# Altium project PCB_Project1.PrjPCB
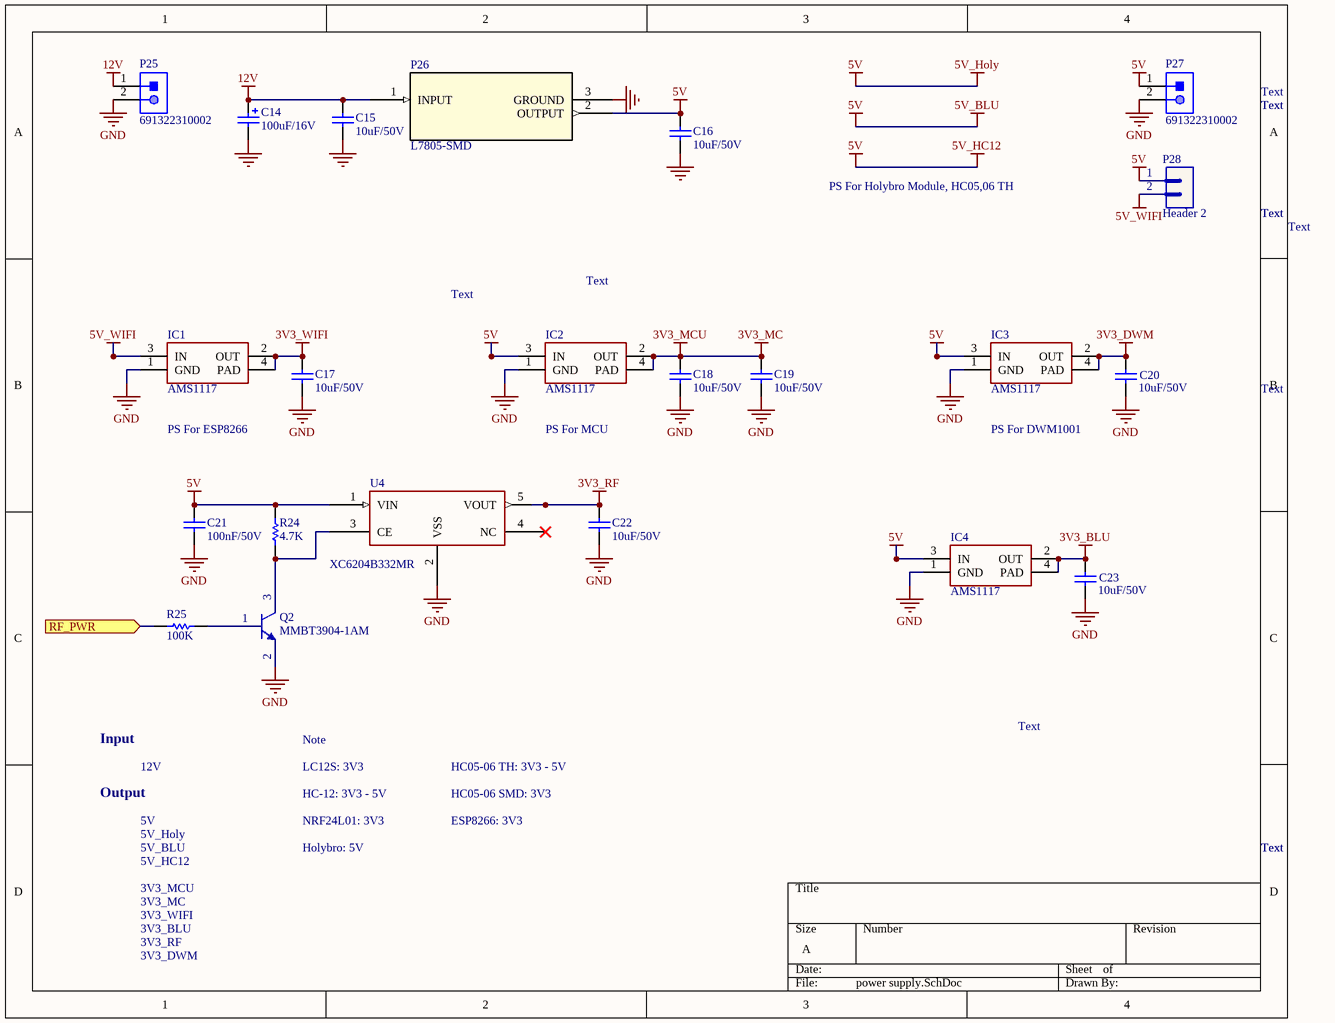
[diagram p0: power supply.SchDoc]
8 sheets, 151 parts. Net scope: flat (ports and power ports of the same name join across sheets).
Board files: xecanbang.PcbDoc, test.PcbDoc
Sheets:
  power supply.SchDoc
  MCU.SchDoc
  sensor.SchDoc
  motor_controller.SchDoc
  bluetooth.SchDoc
  decawave.SchDoc
  wifi.SchDoc
  radio_frequency.SchDoc

## Sheet power supply.SchDoc
size A

### Parts
C14  value 100uF/16V  [CAP-SM-AL-SIZE-D-D6L6]  (hidden comment: Cap-Al-100uF-16V-D6L5)
C15  value 10uF/50V  [CAP-SM-0805]  (hidden comment: Cap-10uF-50V-0805)
C16  value 10uF/50V  [CAP-SM-0805]  (hidden comment: Cap-10uF-50V-0805)
C17  value 10uF/50V  [CAP-SM-0805]  (hidden comment: Cap-10uF-50V-0805)
C18  value 10uF/50V  [CAP-SM-0805]  (hidden comment: Cap-10uF-50V-0805)
C19  value 10uF/50V  [CAP-SM-0805]  (hidden comment: Cap-10uF-50V-0805)
C20  value 10uF/50V  [CAP-SM-0805]  (hidden comment: Cap-10uF-50V-0805)
C21  value 100nF/50V  [CAP-SM-0805]  (hidden comment: Cap-100nF-50V-0805)
C22  value 10uF/50V  [CAP-SM-0805]  (hidden comment: Cap-10uF-50V-0805)
C23  value 10uF/50V  [CAP-SM-0805]  (hidden comment: Cap-10uF-50V-0805)
IC1  AMS1117  [SOT223]
IC2  AMS1117  [SOT223]
IC3  AMS1117  [SOT223]
IC4  AMS1117  [SOT223]
P25  691322310002  [691322310002]
P26  L7805-SMD  [L7805]
P27  691322310002  [691322310002]
P28  Header 2  [JP2]
Q2  MMBT3904-1AM  [SOT23_NEX]
R24  value 4.7K  [RES-SM-0805]  (hidden comment: Res-4.7K-0805)
R25  value 100K  [RES-SM-0805]  (hidden comment: Res-100K-0805)
U4  XC6204B332MR  [XC6204/05_SOT-00]

### Ports
RF_PWR (in)

### Nets
3V3_BLU: C23.2 IC4.2(OUT) IC4.4(PAD)
3V3_DWM: C20.2 IC3.2(OUT) IC3.4(PAD)
3V3_MC: C18.2 C19.2 IC2.2(OUT) IC2.4(PAD)  [also labelled 3V3_MCU]
3V3_RF: C22.2 U4.5(VOUT)
3V3_WIFI: C17.2 IC1.2(OUT) IC1.4(PAD)
5V: C16.2 C21.2 IC2.3(IN) IC3.3(IN) IC4.3(IN) P26.2(OUTPUT) P27.1 P28.1 R24.2 U4.1(VIN)  [also labelled 5V_BLU, 5V_HC12, 5V_Holy]
5V_WIFI: IC1.3(IN) P28.2
12V: C14.1 C15.2 P25.1 P26.1(INPUT)
GND: C14.2 C15.1 C16.1 C17.1 C18.1 C19.1 C20.1 C21.1 C22.1 C23.1 IC1.1(GND) IC2.1(GND) IC3.1(GND) IC4.1(GND) P25.2 P26.3(GROUND) P27.2 Q2.2(E) U4.2(VSS)
NetQ2_1: Q2.1(B) R25.2
NetQ2_3: Q2.3(C) R24.1 U4.3(CE)
NetR25_1: R25.1 ; port RF_PWR

Not connected (* = marked no-connect by the designer): U4 4(NC)*

### Notes on the sheet
- Text
- PS For Holybro Module, HC05,06 TH
- PS For ESP8266
- PS For MCU
- PS For DWM1001
- Input
- 12V
- Note
- LC12S: 3V3
- HC05-06 TH: 3V3 - 5V
- Output
- 5V
- 5V_Holy
- HC-12: 3V3 - 5V
- NRF24L01: 3V3
- HC05-06 SMD: 3V3
- ESP8266: 3V3
- 5V_BLU
- 5V_HC12
- 3V3_MCU
- 3V3_MC
- Holybro: 5V
- 3V3_WIFI
- 3V3_BLU
- 3V3_RF
- 3V3_DWM

### Library data of the parts
C14 = Cap-Al-100uF-16V-D6L5: CAP ALUM 100UF 20% 16V SMD; Manufacturer: Nichicon; Manufacturer Part Number: UWX1C101MCL1GB; Local Supplier: thegioiic; Local Supplier Link: https://thegioiic.com/products/tu-nhom-smd-100uf-16v-d6-3l5-4; Supplier 1: Digikey; Supplier 1 Part Number: 493-2105-1-ND; Supplier 1 Link: https://www.digikey.com/product-detail/en/nichicon/UWX1C101MCL1GB/493-2105-1-ND/590080
C15-C20 C22 C23 = Cap-10uF-50V-0805: CAP CER 10UF 50V X5R 0805; Manufacturer: Yageo; Manufacturer Part Number: CC0805KKX5R9BB106; Local Supplier: thegioiic; Local Supplier Link: https://thegioiic.com/products/tu-10uf-50v-0805; Supplier 1: Digikey; Supplier 1 Link: https://www.digikey.com/product-detail/en/yageo/CC0805KKX5R9BB106/311-3499-2-ND/7164383; Supplier 1 Part Number: 311-3499-2-ND
C21 = Cap-100nF-50V-0805: CAP CER 0.1UF 50V Y5V 0805; Manufacturer: Samsung Electro-Mechanics; Manufacturer Part Number: CL21F104ZBCNNNC; Local Supplier: thegioiic; Local Supplier Link: https://thegioiic.com/products/tu-100nf-0-1uf-50v-0805; Supplier 1: Digikey; Supplier 1 Part Number: 1276-1007-1-ND; Supplier 1 Link: https://www.digikey.com/product-detail/en/samsung-electro-mechanics/CL21F104ZBCNNNC/1276-1007-1-ND/3889093
IC1-IC4 = AMS1117: Available in 1.8V, 2.5V, 2.85V, 3.3V, 5V, and  Adjustable Versions; Value: LM317
P25 P27 = 691322310002: WR-TBL Serie 322 Horizontal PCB Header, Pluggable, pitch 3.81mm, 2p; Compliance: RoHS; Modularity: No; Pin Number: 2; Rated Current [UL]: 10A; Working Voltage [UL]: 300VAC; ComponentLink1Description: Manufacturer; ComponentLink1URL: http://www.we-online.de; ComponentLink2URL: https://katalog.we-online.de/em/datasheet/691322310002.pdf; ComponentLink2Description: Datasheet; Mounting Technology: THT; Part Number: 691322310002; Packaging: Box; Operating Temperature: -40 to +105degC; PCB/Cable/Panel: PCB; Pitch: 3.81mm; Published Date: October 2019; Type: Horizontal; Publisher: Wurth Elektronik; Application: Pluggable
P26 = L7805
P28 = Header 2: Header, 2-Pin; LatestRevisionDate: 17-Jul-2002; LatestRevisionNote: Re-released for DXP Platform.; Publisher: Altium Limited
R24 = Res-4.7K-0805: RES SMD 4.7K OHM 5% 1/8W 0805; Manufacturer: Yageo; Manufacturer Part Number: RC0805JR-074K7L; Local Supplier: thegioiic; Local Supplier Link: https://thegioiic.com/products/dien-tro-4-7k-ohm-0805-5; Supplier 1: Digikey; Supplier 1 Link: https://www.digikey.com/product-detail/en/yageo/RC0805JR-074K7L/311-4.7KARCT-ND/731274; Supplier 1 Part Number: 311-4.7KARCT-ND
R25 = Res-100K-0805: RES 0 OHM JUMPER 0805; Manufacturer: Vishay Dale; Manufacturer Part Number: WSL080500000ZEA9; Local Supplier: thegioiic; Local Supplier Link: https://thegioiic.com/products/dien-tro-0-ohm-0805-5; Supplier 1: Digikey; Supplier 1 Link: https://www.digikey.com/product-detail/en/vishay-dale/WSL080500000ZEA9/541-3928-1-ND/7423223; Supplier 1 Part Number: 541-3928-1-ND
U4 = XC6204B332MR: Vendor: Torex Semiconductor; Built_By: EMA_UL_Team; SourceLibrary: Torex_2016-07-05_1; Manufacturer_Part_Number: XC6204B332MR; Copyright: Copyright (C) 2018 Accelerated Designs. All rights reserved; RefDes: RefDes; Type: DEV

## Sheet MCU.SchDoc
size A
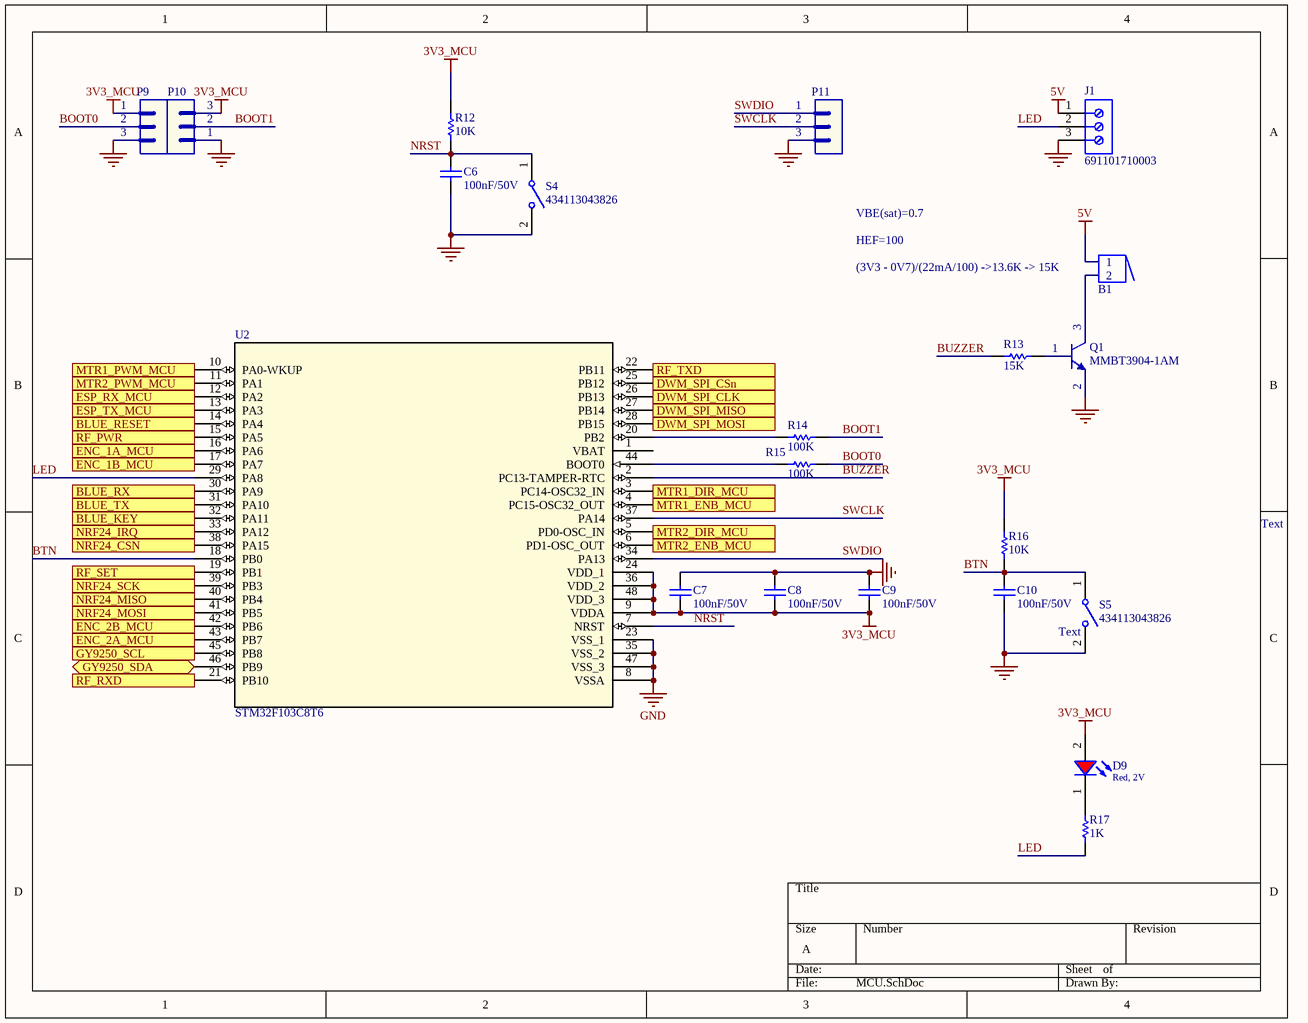
[diagram p1: MCU.SchDoc]

### Parts
B1  Buzzer  [BUZZER]  (value not drawn)
C6  value 100nF/50V  [CAP-SM-0805]  (hidden comment: Cap-100nF-50V-0805)
C7  value 100nF/50V  [CAP-SM-0805]  (hidden comment: Cap-100nF-50V-0805)
C8  value 100nF/50V  [CAP-SM-0805]  (hidden comment: Cap-100nF-50V-0805)
C9  value 100nF/50V  [CAP-SM-0805]  (hidden comment: Cap-100nF-50V-0805)
C10  value 100nF/50V  [CAP-SM-0805]  (hidden comment: Cap-100nF-50V-0805)
D9  Red, 2V  [WL-SMCW_0805]
J1  691101710003  [691101710003]
P9  (no value)  [JP3]
P10  (no value)  [JP3]
P11  (no value)  [JP3]
Q1  MMBT3904-1AM  [SOT23_NEX]
R12  value 10K  [RES-SM-0805]  (hidden comment: Res-10k-0805)
R13  value 15K  [RES-SM-0805]  (hidden comment: Res-15K-0805)
R14  value 100K  [RES-SM-0805]  (hidden comment: Res-100K-0805)
R15  value 100K  [RES-SM-0805]  (hidden comment: Res-100K-0805)
R16  value 10K  [RES-SM-0805]  (hidden comment: Res-10k-0805)
R17  value 1K  [RES-SM-0805]  (hidden comment: Res-1K-0805)
S4  434113043826  [434113043826]
S5  434113043826  [434113043826]
U2  STM32F103C8T6  [LQFP-48]

### Ports
BLUE_KEY (out), BLUE_RESET (out), BLUE_RX (out), BLUE_TX (in), DWM_SPI_CLK (out), DWM_SPI_CSn (out), DWM_SPI_MISO (in), DWM_SPI_MOSI (out), ENC_1A_MCU (in), ENC_1B_MCU (in), ENC_2A_MCU (in), ENC_2B_MCU (in), ESP_RX_MCU (out), ESP_TX_MCU (in), GY9250_SCL (out), GY9250_SDA (bidir), MTR1_DIR_MCU (out), MTR1_ENB_MCU (out), MTR1_PWM_MCU (out), MTR2_DIR_MCU (out), MTR2_ENB_MCU (out), MTR2_PWM_MCU (out), NRF24_CSN (out), NRF24_IRQ (in), NRF24_MISO (in), NRF24_MOSI (out), NRF24_SCK (out), RF_PWR (out), RF_RXD (out), RF_SET (out), RF_TXD (in)

### Nets
3V3_MCU: C7.1 C8.1 C9.1 D9.2(A) P9.1 P10.3 R12.1 R16.1 U2.9(VDDA) U2.24(VDD_1) U2.36(VDD_2) U2.48(VDD_3)  [project net 3V3_MC]
5V: B1.1 J1.1
GND: C6.1 C7.2 C8.2 C9.2 C10.1 J1.3 P9.3 P10.1 P11.3 Q1.2(E) S4.2 S5.2 U2.8(VSSA) U2.23(VSS_1) U2.35(VSS_2) U2.47(VSS_3)
BLUE_RX: U2.30(PA9) ; port BLUE_RX
BLUE_TX: U2.31(PA10) ; port BLUE_TX
BOOT0: P9.2 R15.2
BOOT1: P10.2 R14.2
BTN: C10.2 R16.2 S5.1 U2.18(PB0)
BUZZER: R13.1 U2.2(PC13-TAMPER-RTC)
DWM_SPI_CLK: U2.26(PB13) ; port DWM_SPI_CLK
DWM_SPI_CSn: U2.25(PB12) ; port DWM_SPI_CSn
DWM_SPI_MISO: U2.27(PB14) ; port DWM_SPI_MISO
DWM_SPI_MOSI: U2.28(PB15) ; port DWM_SPI_MOSI
ESP_TX: U2.13(PA3) ; port ESP_TX_MCU
LED: J1.2 R17.1 U2.29(PA8)
NRST: C6.2 R12.2 S4.1 U2.7(NRST)
SWCLK: P11.2 U2.37(PA14)
SWDIO: P11.1 U2.34(PA13)
NetB1_2: B1.2 Q1.3(C)
NetD9_1: D9.1(K) R17.2
NetM2_11: U2.14(PA4) ; port BLUE_RESET
NetM5_4: U2.38(PA15) ; port NRF24_CSN
NetM5_5: U2.39(PB3) ; port NRF24_SCK
NetM5_6: U2.41(PB5) ; port NRF24_MOSI
NetM5_7: U2.40(PB4) ; port NRF24_MISO
NetM5_8: U2.33(PA12) ; port NRF24_IRQ
NetM6_2: U2.21(PB10) ; port RF_RXD
NetM6_3: U2.22(PB11) ; port RF_TXD
NetM6_4: U2.19(PB1) ; port RF_SET
NetM9_3: U2.45(PB8) ; port GY9250_SCL
NetM9_4: U2.46(PB9) ; port GY9250_SDA
NetQ1_1: Q1.1(B) R13.2
NetR14_1: R14.1 U2.20(PB2)
NetR15_1: R15.1 U2.44(BOOT0)
NetR25_1: U2.15(PA5) ; port RF_PWR
NetR28_1: U2.12(PA2) ; port ESP_RX_MCU
NetU2_3: U2.3(PC14-OSC32_IN) ; port MTR1_DIR_MCU
NetU2_4: U2.4(PC15-OSC32_OUT) ; port MTR1_ENB_MCU
NetU2_5: U2.5(PD0-OSC_IN) ; port MTR2_DIR_MCU
NetU2_6: U2.6(PD1-OSC_OUT) ; port MTR2_ENB_MCU
NetU2_10: U2.10(PA0-WKUP) ; port MTR1_PWM_MCU
NetU2_11: U2.11(PA1) ; port MTR2_PWM_MCU
NetU2_16: U2.16(PA6) ; port ENC_1A_MCU
NetU2_17: U2.17(PA7) ; port ENC_1B_MCU
NetU2_32: U2.32(PA11) ; port BLUE_KEY
NetU2_42: U2.42(PB6) ; port ENC_2B_MCU
NetU2_43: U2.43(PB7) ; port ENC_2A_MCU

Not connected (* = marked no-connect by the designer): U2 1(VBAT)

### Notes on the sheet
- VBE(sat)=0.7
- HEF=100
- (near B1) (3V3 - 0V7)/(22mA/100) ->13.6K -> 15K
- Text
- (near S5) Text

### Library data of the parts
C6-C10 = Cap-100nF-50V-0805: as C21 on sheet power supply; Local Supplier: thegioiic; Local Supplier Link: https://thegioiic.com/products/tu-100nf-0-1uf-50v-0805; Supplier 1: Digikey; Supplier 1 Part Number: 1276-1007-1-ND; Supplier 1 Link: https://www.digikey.com/product-detail/en/samsung-electro-mechanics/CL21F104ZBCNNNC/1276-1007-1-ND/3889093
D9 = 150080RS75000: WL-SMCW SMT Mono-color Chip LED Waterclear, size 0805, Red, 2V, 140deg; Chip Technology: AlInGaP; Dominant Wavelength typ.: 625nm; Luminous Intensity typ.: 150mcd; Peak Wavelength typ.: 630nm; Viewing Angle: 140deg; ComponentLink1Description: Manufacturer; ComponentLink1URL: http://www.we-online.de; ComponentLink2URL: https://www.we-online.com/catalog/datasheet/150080RS75000.pdf; ComponentLink2Description: Datasheet; Forward Voltage typ.: 2V; Emitting Color: Red; Mounting Technology: SMT; Operating Temperature: -40 to +85degC; Published Date: December 2019; Part Number: 150080RS75000; Packaging: Tape and Reel; Size: 0805; Publisher: Wurth Elektronik
J1 = 691101710003: WR-TBL Serie 101 Horizontal Entry Modular, Pressure Clamp, pitch 5mm, 3p; Compliance: Lead free / RoHS; Modularity: Yes; PCB/Cable/Panel: PCB; Pin Number: 3; Rated Current [UL]: 16A; Working Voltage [UL]: 250VAC; ComponentLink1Description: Manufacturer; ComponentLink1URL: http://www.we-online.de; ComponentLink2URL: https://katalog.we-online.de/em/datasheet/691101710003.pdf; ComponentLink2Description: Datasheet; Mounting Technology: THT; Part Number: 691101710003; Packaging: Box; Operating Temperature: -40 to +105degC; Pitch: 5mm; Published Date: October 2019; Type: Horizontal; Publisher: Wurth Elektronik; Application: Pressure Clamp
P9-P11 = Header 3: Header, 3-Pin; LatestRevisionDate: 17-Jul-2002; LatestRevisionNote: Re-released for DXP Platform.; Publisher: Altium Limited
R12 R16 = Res-10k-0805: RES 10K OHM 1% 1/4W 0805; Manufacturer: Stackpole Electronics Inc; Manufacturer Part Number: RNCP0805FTD10K0; Local Supplier: thegioiic; Local Supplier Link: https://thegioiic.com/products/dien-tro-10k-ohm-0805-5; Supplier 1: Digikey; Supplier 1 Link: https://www.digikey.com/product-detail/en/stackpole-electronics-inc/RNCP0805FTD10K0/RNCP0805FTD10K0CT-ND/2240601; Supplier 1 Part Number: RNCP0805FTD10K0CT-ND
R13 = Res-15K-0805: RES 15K OHM 1% 1/4W 0805; Manufacturer: TE Connectivity Passive Product; Manufacturer Part Number: CRGCQ0805F15K; Local Supplier: thegioiic; Local Supplier Link: https://thegioiic.com/products/dien-tro-15k-ohm-0805-1; Supplier 1: Digikey; Supplier 1 Part Number: A129763CT-ND; Supplier 1 Link: https://www.digikey.com/product-detail/en/te-connectivity-passive-product/CRGCQ0805F15K/A129763CT-ND/8577595
R14 R15 = Res-100K-0805: as R25 on sheet power supply; Local Supplier: thegioiic; Local Supplier Link: https://thegioiic.com/products/dien-tro-0-ohm-0805-5; Supplier 1: Digikey; Supplier 1 Link: https://www.digikey.com/product-detail/en/vishay-dale/WSL080500000ZEA9/541-3928-1-ND/7423223; Supplier 1 Part Number: 541-3928-1-ND
R17 = Res-1K-0805: RES 1K OHM 1% 1/4W 0805; Manufacturer: Stackpole Electronics Inc; Manufacturer Part Number: RNCP0805FTD1K00; Local Supplier: thegioiic; Local Supplier Link: https://thegioiic.com/products/dien-tro-1k-ohm-0805-5; Supplier 1: Digikey; Supplier 1 Link: https://www.digikey.com/product-detail/en/stackpole-electronics-inc/RNCP0805FTD1K00/RNCP0805FTD1K00CT-ND/2240568; Supplier 1 Part Number: RNCP0805FTD1K00CT-ND
S4 S5 = 434113043826: WS-TASV J-Bend SMT Tact Switch 6x3.5mm, height 4.3mm, 260gf; Rated Voltage: 12VDC; Rated Current: 50mA; Washable: No; ComponentLink1Description: Manufacturer; ComponentLink1URL: http://www.we-online.de; ComponentLink2Description: Datasheet; ComponentLink2URL: https://katalog.we-online.com/em/datasheet/434113043826.pdf; Operating Temperature: -40 to +85degC; Part Number: 434113043826; Published Date: September 2019; Contact Material: Stainless Steel; Height: 4.3mm; Mounting Technology: SMT; Contact Plating: Silver; Operation Force: 260gf; Packaging: Tape and Reel; Terminal Material: Copper Alloy; Publisher: Wurth Elektronik; Terminal Plating: Silver
U2 = STM32F103C8T6: No Description Available; Vendor: STMicroelectronics; Built_By: EMA_UL_Team; Manufacturer_Part_Number: STM32F103C8T6; Copyright: Copyright (C) 2018 Accelerated Designs. All rights reserved; RefDes: RefDes; Type: DEV

## Sheet sensor.SchDoc
size A
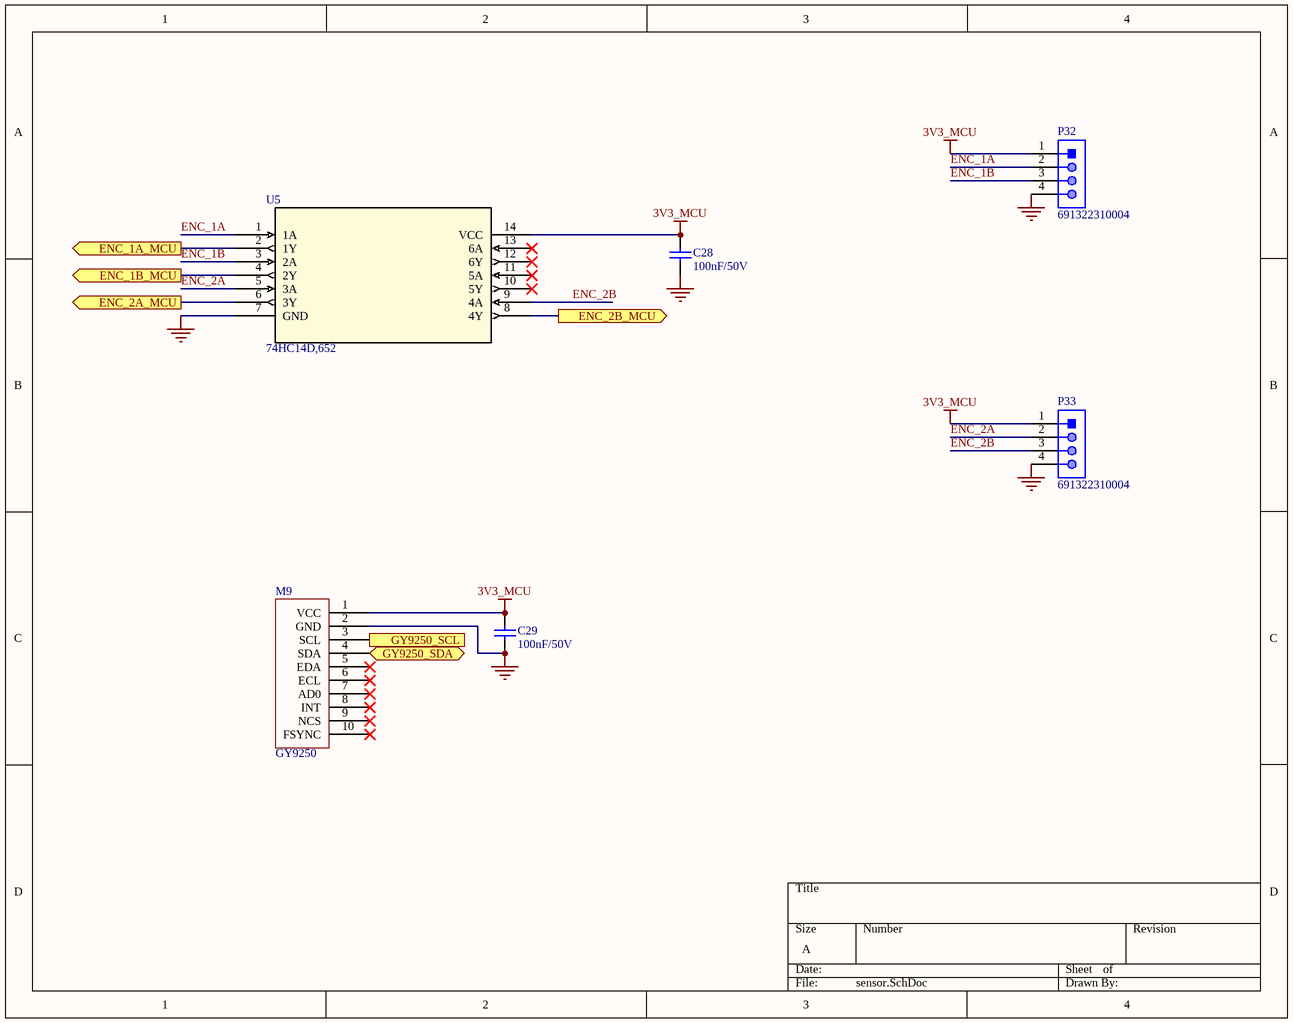
[diagram p2: sensor.SchDoc]

### Parts
C28  value 100nF/50V  [CAP-SM-0805]  (hidden comment: Cap-100nF-50V-0805)
C29  value 100nF/50V  [CAP-SM-0805]  (hidden comment: Cap-100nF-50V-0805)
M9  GY9250  [GY9250]
P32  691322310004  [691322310004]
P33  691322310004  [691322310004]
U5  74HC14D,652  [SOT108-1_NEX]

### Ports
ENC_1A_MCU (out), ENC_1B_MCU (out), ENC_2A_MCU (out), ENC_2B_MCU (out), GY9250_SCL (in), GY9250_SDA (bidir)

### Nets
3V3_MCU: C28.2 C29.2 M9.1(VCC) P32.1 P33.1 U5.14(VCC)  [project net 3V3_MC]
GND: C28.1 C29.1 M9.2(GND) P32.4 P33.4 U5.7(GND)
ENC_1A: P32.2 U5.1(1A)
ENC_1B: P32.3 U5.3(2A)
ENC_2A: P33.2 U5.5(3A)
ENC_2B: P33.3 U5.9(4A)
NetM9_3: M9.3(SCL) ; port GY9250_SCL
NetM9_4: M9.4(SDA) ; port GY9250_SDA
NetU2_16: U5.2(1Y) ; port ENC_1A_MCU
NetU2_17: U5.4(2Y) ; port ENC_1B_MCU
NetU2_42: U5.8(4Y) ; port ENC_2B_MCU
NetU2_43: U5.6(3Y) ; port ENC_2A_MCU

Not connected (* = marked no-connect by the designer): M9 5(EDA)* 6(ECL)* 7(AD0)* 8(INT)* 9(NCS)* 10(FSYNC)*; U5 10(5Y)* 11(5A)* 12(6Y)* 13(6A)*

### Library data of the parts
C28 C29 = Cap-100nF-50V-0805: as C21 on sheet power supply; Local Supplier: thegioiic; Local Supplier Link: https://thegioiic.com/products/tu-100nf-0-1uf-50v-0805; Supplier 1: Digikey; Supplier 1 Part Number: 1276-1007-1-ND; Supplier 1 Link: https://www.digikey.com/product-detail/en/samsung-electro-mechanics/CL21F104ZBCNNNC/1276-1007-1-ND/3889093
P32 P33 = 691322310004: WR-TBL Serie 322 Horizontal PCB Header, Pluggable, pitch 3.81mm, 4p; Compliance: RoHS; Modularity: No; Pin Number: 4; Rated Current [UL]: 10A; Working Voltage [UL]: 300VAC; ComponentLink1Description: Manufacturer; ComponentLink1URL: http://www.we-online.de; ComponentLink2URL: https://katalog.we-online.de/em/datasheet/691322310004.pdf; ComponentLink2Description: Datasheet; Mounting Technology: THT; Part Number: 691322310004; Packaging: Box; Operating Temperature: -40 to +105degC; PCB/Cable/Panel: PCB; Pitch: 3.81mm; Published Date: October 2019; Type: Horizontal; Publisher: Wurth Elektronik; Application: Pluggable
U5 = 74HC14D,652: No Description Available; Vendor: Nexperia; SourceLibrary: Nexperia_2018-05-2018; Manufacturer_Part_Number: 74HC14D,652; Copyright: Copyright (C) 2016 Accelerated Designs. All rights reserved; RefDes: RefDes; Type: DEV

## Sheet motor_controller.SchDoc
size A
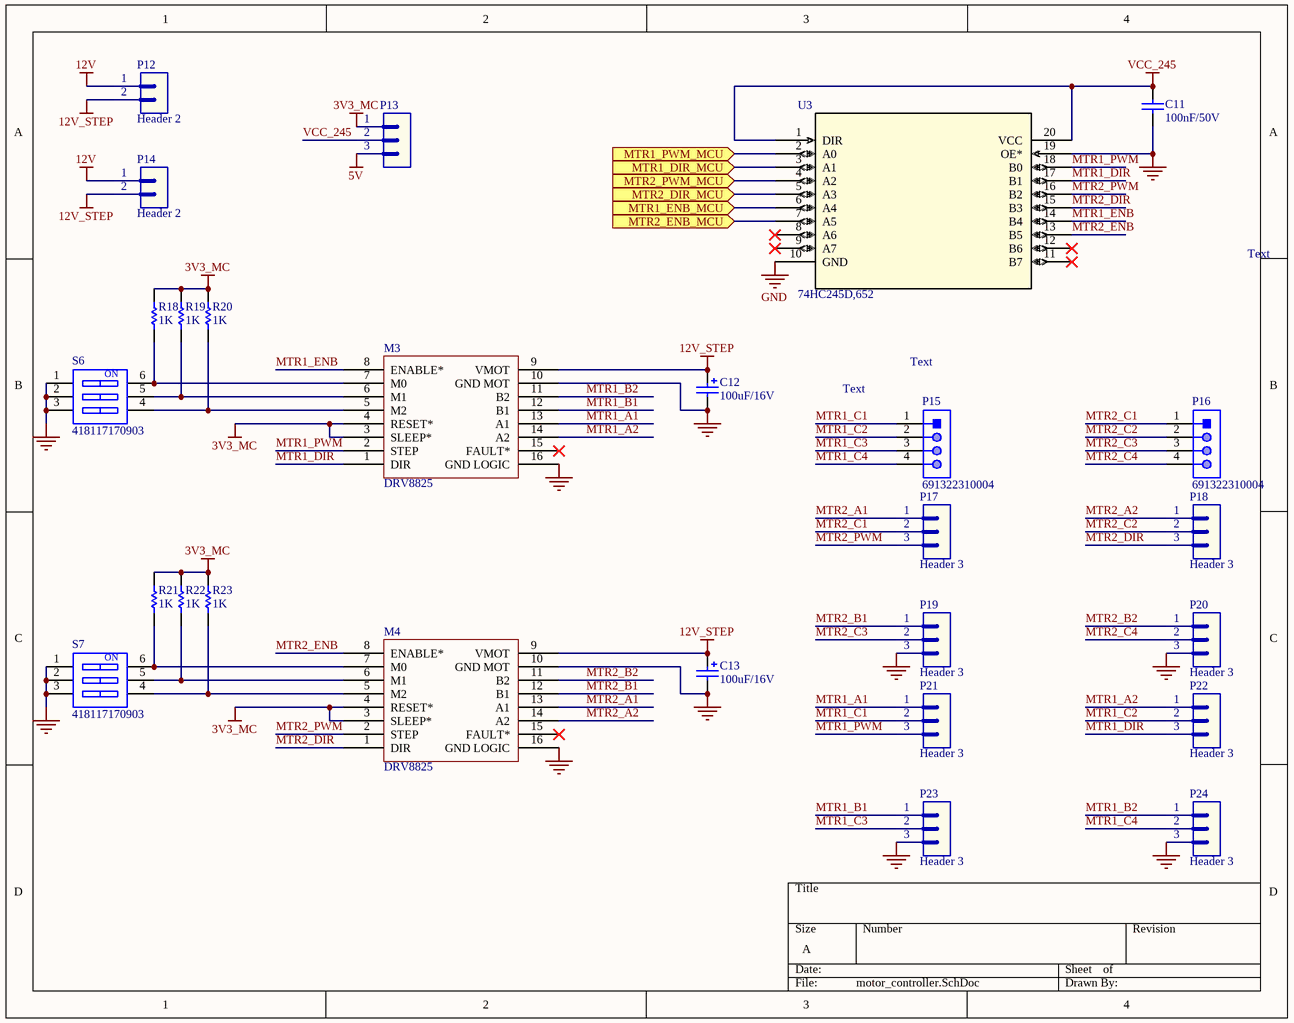
[diagram p3: motor_controller.SchDoc]

### Parts
C11  value 100nF/50V  [CAP-SM-0805]  (hidden comment: Cap-100nF-50V-0805)
C12  value 100uF/16V  [CAP-SM-AL-SIZE-D-D6L6]  (hidden comment: Cap-Al-100uF-16V-D6L5)
C13  value 100uF/16V  [CAP-SM-AL-SIZE-D-D6L6]  (hidden comment: Cap-Al-100uF-16V-D6L5)
M3  DRV8825  [DRV8825]
M4  DRV8825  [DRV8825]
P12  Header 2  [JP2]
P13  Header 3  [JP3]  (value not drawn)
P14  Header 2  [JP2]
P15  691322310004  [691322310004]
P16  691322310004  [691322310004]
P17  Header 3  [JP3]
P18  Header 3  [JP3]
P19  Header 3  [JP3]
P20  Header 3  [JP3]
P21  Header 3  [JP3]
P22  Header 3  [JP3]
P23  Header 3  [JP3]
P24  Header 3  [JP3]
R18  value 1K  [RES-SM-0805]  (hidden comment: Res-1K-0805)
R19  value 1K  [RES-SM-0805]  (hidden comment: Res-1K-0805)
R20  value 1K  [RES-SM-0805]  (hidden comment: Res-1K-0805)
R21  value 1K  [RES-SM-0805]  (hidden comment: Res-1K-0805)
R22  value 1K  [RES-SM-0805]  (hidden comment: Res-1K-0805)
R23  value 1K  [RES-SM-0805]  (hidden comment: Res-1K-0805)
S6  418117170903  [418117170903]
S7  418117170903  [418117170903]
U3  74HC245D,652  [SOT163-1_NEX]

### Ports
MTR1_DIR_MCU (in), MTR1_ENB_MCU (in), MTR1_PWM_MCU (in), MTR2_DIR_MCU (in), MTR2_ENB_MCU (in), MTR2_PWM_MCU (in)

### Nets
3V3_MC: M3.3(SLEEP*) M3.4(RESET*) M4.3(SLEEP*) M4.4(RESET*) P13.1 R18.2 R19.2 R20.2 R21.2 R22.2 R23.2
5V: P13.3
12V: P12.1 P14.1
12V_STEP: C12.1 C13.1 M3.9(VMOT) M4.9(VMOT) P12.2 P14.2
GND: C11.1 C12.2 C13.2 M3.10(GND_MOT) M3.16(GND_LOGIC) M4.10(GND_MOT) M4.16(GND_LOGIC) P19.3 P20.3 P23.3 P24.3 S6.1 S6.2 S6.3 S7.1 S7.2 S7.3 U3.10(GND) U3.19(OE*)
VCC_245: C11.2 P13.2 U3.1(DIR) U3.20(VCC)
MTR1_A1: M3.13(A1) P21.1
MTR1_A2: M3.14(A2) P22.1
MTR1_B1: M3.12(B1) P23.1
MTR1_B2: M3.11(B2) P24.1
MTR1_C1: P15.1 P21.2
MTR1_C2: P15.2 P22.2
MTR1_C3: P15.3 P23.2
MTR1_C4: P15.4 P24.2
MTR1_DIR: M3.1(DIR) P22.3 U3.17(B1)
MTR1_ENB: M3.8(ENABLE*) U3.14(B4)
MTR1_PWM: M3.2(STEP) P21.3 U3.18(B0)
MTR2_A1: M4.13(A1) P17.1
MTR2_A2: M4.14(A2) P18.1
MTR2_B1: M4.12(B1) P19.1
MTR2_B2: M4.11(B2) P20.1
MTR2_C1: P16.1 P17.2
MTR2_C2: P16.2 P18.2
MTR2_C3: P16.3 P19.2
MTR2_C4: P16.4 P20.2
MTR2_DIR: M4.1(DIR) P18.3 U3.15(B3)
MTR2_ENB: M4.8(ENABLE*) U3.13(B5)
MTR2_PWM: M4.2(STEP) P17.3 U3.16(B2)
NetM3_5: M3.5(M2) R20.1 S6.4
NetM3_6: M3.6(M1) R19.1 S6.5
NetM3_7: M3.7(M0) R18.1 S6.6
NetM4_5: M4.5(M2) R23.1 S7.4
NetM4_6: M4.6(M1) R22.1 S7.5
NetM4_7: M4.7(M0) R21.1 S7.6
NetU2_3: U3.3(A1) ; port MTR1_DIR_MCU
NetU2_4: U3.6(A4) ; port MTR1_ENB_MCU
NetU2_5: U3.5(A3) ; port MTR2_DIR_MCU
NetU2_6: U3.7(A5) ; port MTR2_ENB_MCU
NetU2_10: U3.2(A0) ; port MTR1_PWM_MCU
NetU2_11: U3.4(A2) ; port MTR2_PWM_MCU

Not connected (* = marked no-connect by the designer): M3 15(FAULT*)*; M4 15(FAULT*)*; U3 8(A6)* 9(A7)* 11(B7)* 12(B6)*

### Notes on the sheet
- Text
- (in symbol 418117170903) ON

### Library data of the parts
C11 = Cap-100nF-50V-0805: as C21 on sheet power supply; Local Supplier: thegioiic; Local Supplier Link: https://thegioiic.com/products/tu-100nf-0-1uf-50v-0805; Supplier 1: Digikey; Supplier 1 Part Number: 1276-1007-1-ND; Supplier 1 Link: https://www.digikey.com/product-detail/en/samsung-electro-mechanics/CL21F104ZBCNNNC/1276-1007-1-ND/3889093
C12 C13 = Cap-Al-100uF-16V-D6L5: as C14 on sheet power supply; Local Supplier: thegioiic; Local Supplier Link: https://thegioiic.com/products/tu-nhom-smd-100uf-16v-d6-3l5-4; Supplier 1: Digikey; Supplier 1 Part Number: 493-2105-1-ND; Supplier 1 Link: https://www.digikey.com/product-detail/en/nichicon/UWX1C101MCL1GB/493-2105-1-ND/590080
P12 P14 = Header 2: Header, 2-Pin; LatestRevisionDate: 17-Jul-2002; LatestRevisionNote: Re-released for DXP Platform.; Publisher: Altium Limited
P13 P17-P24 = Header 3: Header, 3-Pin; LatestRevisionDate: 17-Jul-2002; LatestRevisionNote: Re-released for DXP Platform.; Publisher: Altium Limited
P15 P16 = 691322310004: as P32 on sheet sensor; ComponentLink1Description: Manufacturer; ComponentLink1URL: http://www.we-online.de; ComponentLink2URL: https://katalog.we-online.de/em/datasheet/691322310004.pdf; ComponentLink2Description: Datasheet; Mounting Technology: THT; Part Number: 691322310004; Packaging: Box; Operating Temperature: -40 to +105degC; PCB/Cable/Panel: PCB; Pitch: 3.81mm; Published Date: October 2019; Type: Horizontal; Publisher: Wurth Elektronik; Application: Pluggable
R18-R23 = Res-1K-0805: as R17 on sheet MCU; Local Supplier: thegioiic; Local Supplier Link: https://thegioiic.com/products/dien-tro-1k-ohm-0805-5; Supplier 1: Digikey; Supplier 1 Link: https://www.digikey.com/product-detail/en/stackpole-electronics-inc/RNCP0805FTD1K00/RNCP0805FTD1K00CT-ND/2240568; Supplier 1 Part Number: RNCP0805FTD1K00CT-ND
S6 S7 = 418117170903: WS-DITV Compact THT Dip Switch, Flat Actuator, pitch 2.54mm, 3p; Operation Force: 800g; Pole Number: 3; Actuator Type: Flat Type; Circuit: SPST-NO; Rated Current Switching: 25mA; Rated Current Non-Switching: 100mA; Rated Voltage Non-Switching: 50VDC; Rated Voltage Switching: 24VDC; ComponentLink1Description: Manufacturer; ComponentLink1URL: http://www.we-online.de; ComponentLink2Description: Datasheet; ComponentLink2URL: https://katalog.we-online.com/em/datasheet/418117170903.pdf; Pitch: 2.54mm; Contact Material: Copper Alloy; Mounting Technology: THT; Operating Temperature: -40 to +85degC; Contact Plating: Gold; Packaging: Tube; Part Number: 418117170903; Publisher: Wurth Elektronik; Published Date: September 2019
U3 = 74HC245D,652: No Description Available; Vendor: Nexperia; SourceLibrary: Nexperia_2018-05-2018; Manufacturer_Part_Number: 74HC245D,652; Copyright: Copyright (C) 2016 Accelerated Designs. All rights reserved; RefDes: RefDes; Type: DEV

## Sheet bluetooth.SchDoc
size A
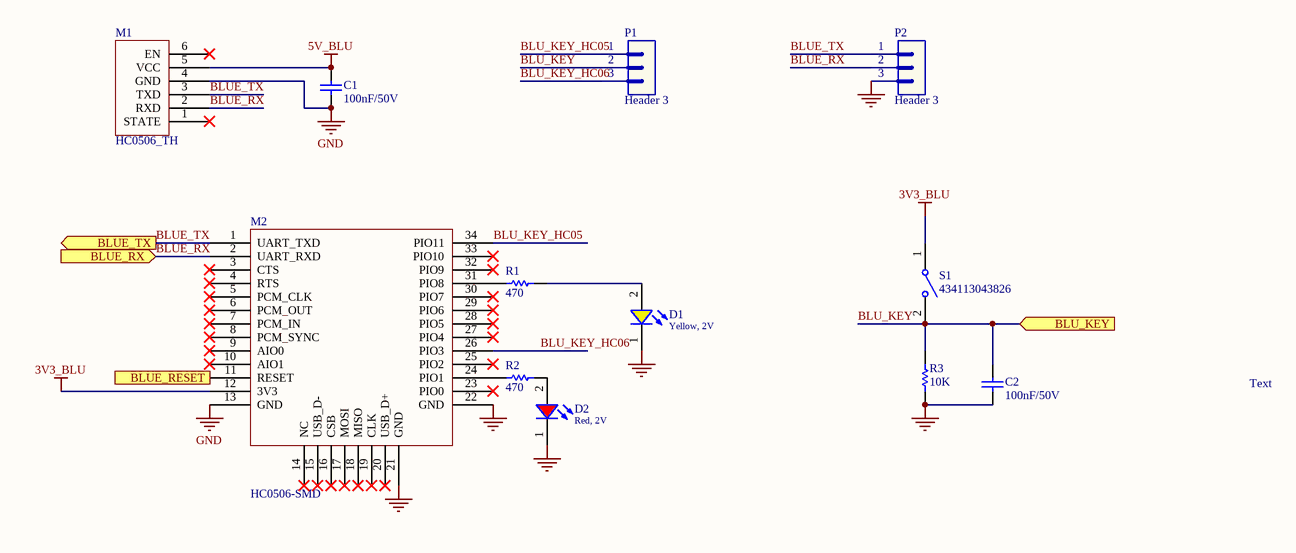
[diagram p4: bluetooth.SchDoc]

### Parts
C1  value 100nF/50V  [CAP-SM-0805]  (hidden comment: Cap-100nF-50V-0805)
C2  value 100nF/50V  [CAP-SM-0805]  (hidden comment: Cap-100nF-50V-0805)
D1  Yellow, 2V  [WL-SMCW_0805]
D2  Red, 2V  [WL-SMCW_0805]
M1  HC0506_TH  [HC0506-TH]
M2  HC0506-SMD  [HC0506-SMD]
P1  Header 3  [JP3]
P2  Header 3  [JP3]
R1  value 470  [RES-SM-0805]  (hidden comment: Res-470-0805)
R2  value 470  [RES-SM-0805]  (hidden comment: Res-470-0805)
R3  value 10K  [RES-SM-0805]  (hidden comment: Res-10k-0805)
S1  434113043826  [434113043826]

### Ports
BLU_KEY (in), BLUE_RESET (in), BLUE_RX (in), BLUE_TX (out)

### Nets
3V3_BLU: M2.12(3V3) S1.1
5V_BLU: C1.2 M1.5(VCC)  [project net 5V]
GND: C1.1 C2.1 D1.1(K) D2.1(K) M1.4(GND) M2.13(GND) M2.21(GND) M2.22(GND) P2.3 R3.1
BLU_KEY: C2.2 P1.2 R3.2 S1.2 ; port BLU_KEY
BLU_KEY_HC05: M2.34(PIO11) P1.1
BLU_KEY_HC06: M2.26(PIO3) P1.3
BLUE_RX: M1.2(RXD) M2.2(UART_RXD) P2.2 ; port BLUE_RX
BLUE_TX: M1.3(TXD) M2.1(UART_TXD) P2.1 ; port BLUE_TX
NetD1_2: D1.2(A) R1.2
NetD2_2: D2.2(A) R2.2
NetM2_11: M2.11(RESET) ; port BLUE_RESET
NetM2_24: M2.24(PIO1) R2.1
NetM2_31: M2.31(PIO8) R1.1

Not connected (* = marked no-connect by the designer): M1 1(STATE)* 6(EN)*; M2 3(CTS)* 4(RTS)* 5(PCM_CLK)* 6(PCM_OUT)* 7(PCM_IN)* 8(PCM_SYNC)* 9(AIO0)* 10(AIO1)* 14(NC)* 15(USB_D-)* 16(CSB)* 17(MOSI)* 18(MISO)* 19(CLK)* 20(USB_D+)* 23(PIO0)* 25(PIO2)* 27(PIO4)* 28(PIO5)* 29(PIO6)* 30(PIO7)* 32(PIO9)* 33(PIO10)*

### Notes on the sheet
- Text

### Library data of the parts
C1 C2 = Cap-100nF-50V-0805: as C21 on sheet power supply; Local Supplier: thegioiic; Local Supplier Link: https://thegioiic.com/products/tu-100nf-0-1uf-50v-0805; Supplier 1: Digikey; Supplier 1 Part Number: 1276-1007-1-ND; Supplier 1 Link: https://www.digikey.com/product-detail/en/samsung-electro-mechanics/CL21F104ZBCNNNC/1276-1007-1-ND/3889093
D1 = 150080YS75000: WL-SMCW SMT Mono-color Chip LED Waterclear, size 0805, Yellow, 2V, 140deg; Chip Technology: AlInGaP; Dominant Wavelength typ.: 590nm; Luminous Intensity typ.: 120mcd; Peak Wavelength typ.: 595nm; Viewing Angle: 140deg; ComponentLink1Description: Manufacturer; ComponentLink1URL: http://www.we-online.de; ComponentLink2URL: https://www.we-online.com/catalog/datasheet/150080YS75000.pdf; ComponentLink2Description: Datasheet; Forward Voltage typ.: 2V; Emitting Color: Yellow; Mounting Technology: SMT; Operating Temperature: -40 to +85degC; Published Date: December 2019; Part Number: 150080YS75000; Packaging: Tape and Reel; Size: 0805; Publisher: Wurth Elektronik
D2 = 150080RS75000: as D9 on sheet MCU; Viewing Angle: 140deg; ComponentLink1Description: Manufacturer; ComponentLink1URL: http://www.we-online.de; ComponentLink2URL: https://www.we-online.com/catalog/datasheet/150080RS75000.pdf; ComponentLink2Description: Datasheet; Forward Voltage typ.: 2V; Emitting Color: Red; Mounting Technology: SMT; Operating Temperature: -40 to +85degC; Published Date: December 2019; Part Number: 150080RS75000; Packaging: Tape and Reel; Size: 0805; Publisher: Wurth Elektronik
P1 P2 = Header 3: Header, 3-Pin; LatestRevisionDate: 17-Jul-2002; LatestRevisionNote: Re-released for DXP Platform.; Publisher: Altium Limited
R1 R2 = Res-470-0805: RES 470 OHM JUMPER 0805; Manufacturer: YAG6006CT-ND; Manufacturer Part Number: PE0805FRF7W0R047L; Local Supplier: thegioiic; Local Supplier Link: https://www.thegioiic.com/products/dien-tro-470-kohm-0805-5; Supplier 1: Digikey; Supplier 1 Link: https://www.digikey.com/product-detail/en/yageo/PE0805FRF7W0R047L/YAG6006CT-ND/9696460; Supplier 1 Part Number: YAG6006CT-ND
R3 = Res-10k-0805: as R12 on sheet MCU; Local Supplier: thegioiic; Local Supplier Link: https://thegioiic.com/products/dien-tro-10k-ohm-0805-5; Supplier 1: Digikey; Supplier 1 Link: https://www.digikey.com/product-detail/en/stackpole-electronics-inc/RNCP0805FTD10K0/RNCP0805FTD10K0CT-ND/2240601; Supplier 1 Part Number: RNCP0805FTD10K0CT-ND
S1 = 434113043826: as S4 on sheet MCU; ComponentLink1Description: Manufacturer; ComponentLink1URL: http://www.we-online.de; ComponentLink2Description: Datasheet; ComponentLink2URL: https://katalog.we-online.com/em/datasheet/434113043826.pdf; Operating Temperature: -40 to +85degC; Part Number: 434113043826; Published Date: September 2019; Contact Material: Stainless Steel; Height: 4.3mm; Mounting Technology: SMT; Contact Plating: Silver; Operation Force: 260gf; Packaging: Tape and Reel; Terminal Material: Copper Alloy; Publisher: Wurth Elektronik; Terminal Plating: Silver

## Sheet decawave.SchDoc
size A
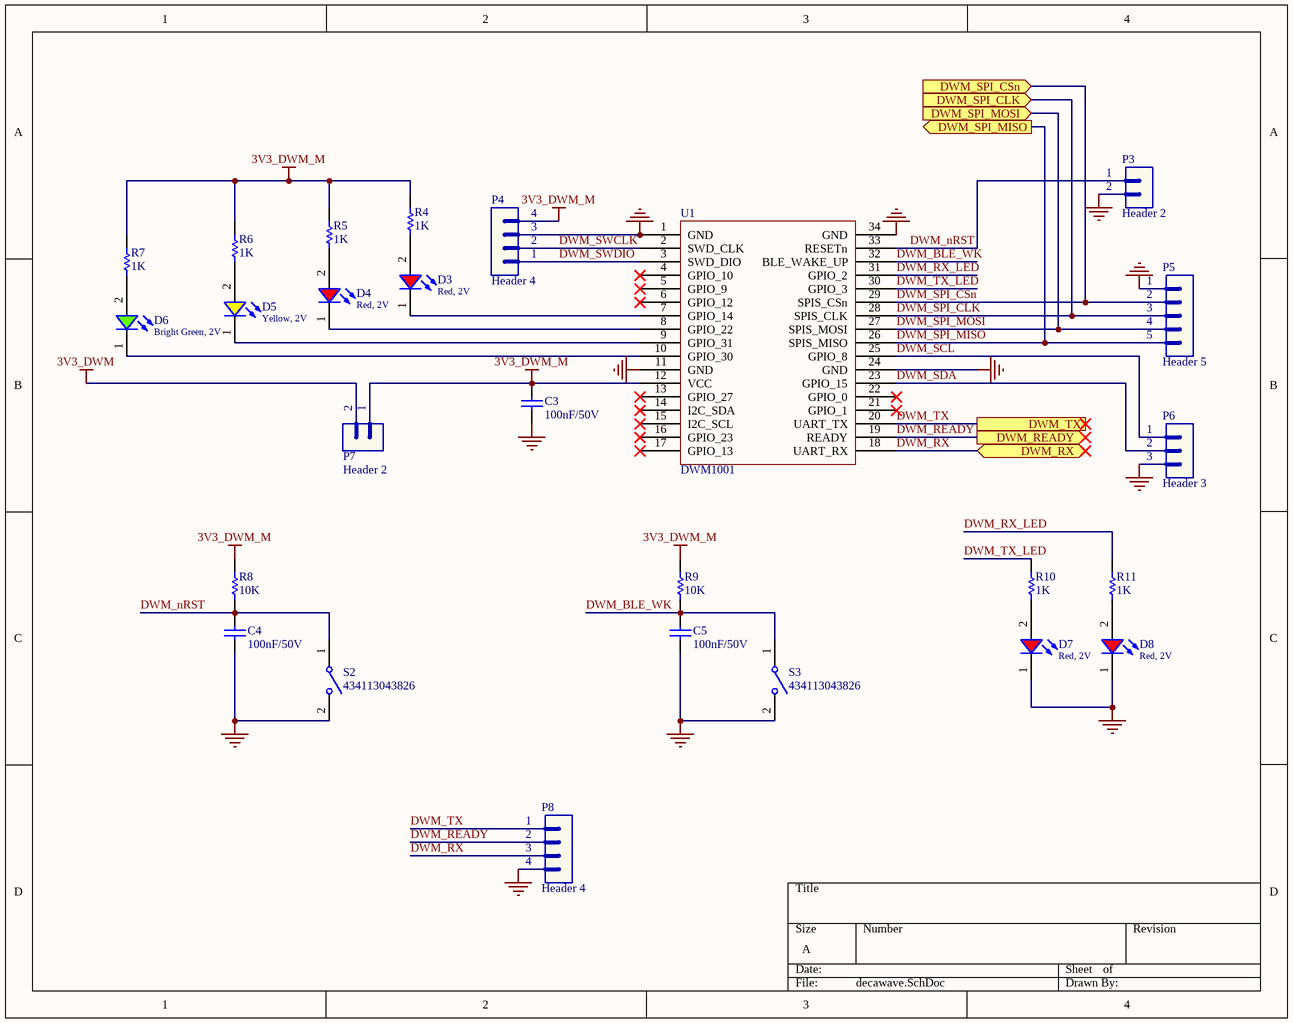
[diagram p5: decawave.SchDoc]

### Parts
C3  value 100nF/50V  [CAP-SM-0805]  (hidden comment: Cap-100nF-50V-0805)
C4  value 100nF/50V  [CAP-SM-0805]  (hidden comment: Cap-100nF-50V-0805)
C5  value 100nF/50V  [CAP-SM-0805]  (hidden comment: Cap-100nF-50V-0805)
D3  Red, 2V  [WL-SMCW_0805]
D4  Red, 2V  [WL-SMCW_0805]
D5  Yellow, 2V  [WL-SMCW_0805]
D6  Bright Green, 2V  [WL-SMCW_0805]
D7  Red, 2V  [WL-SMCW_0805]
D8  Red, 2V  [WL-SMCW_0805]
P3  Header 2  [JP2]
P4  Header 4  [JP4]
P5  Header 5  [JP5]
P6  Header 3  [JP3]
P7  Header 2  [JP2]
P8  Header 4  [JP4]
R4  value 1K  [RES-SM-0805]  (hidden comment: Res-1K-0805)
R5  value 1K  [RES-SM-0805]  (hidden comment: Res-1K-0805)
R6  value 1K  [RES-SM-0805]  (hidden comment: Res-1K-0805)
R7  value 1K  [RES-SM-0805]  (hidden comment: Res-1K-0805)
R8  value 10K  [RES-SM-0805]  (hidden comment: Res-10k-0805)
R9  value 10K  [RES-SM-0805]  (hidden comment: Res-10k-0805)
R10  value 1K  [RES-SM-0805]  (hidden comment: Res-1K-0805)
R11  value 1K  [RES-SM-0805]  (hidden comment: Res-1K-0805)
S2  434113043826  [434113043826]
S3  434113043826  [434113043826]
U1  DWM1001  [DWM1001]

### Ports
DWM_READY (out), DWM_RX (bidir), DWM_SPI_CLK (in), DWM_SPI_CSn (in), DWM_SPI_MISO (out), DWM_SPI_MOSI (in), DWM_TX

### Nets
3V3_DWM: P7.2
3V3_DWM_M: C3.2 P4.4 P7.1 R4.1 R5.1 R6.1 R7.1 R8.2 R9.2 U1.12(VCC)
GND: C3.1 C4.1 C5.1 D7.1(K) D8.1(K) P3.2 P4.3 P5.1 P6.3 P8.4 S2.2 S3.2 U1.1(GND) U1.11(GND) U1.24(GND) U1.34(GND)
DWM_BLE_WK: C5.2 R9.1 S3.1 U1.32(BLE_WAKE_UP)
DWM_nRST: C4.2 P3.1 R8.1 S2.1 U1.33(RESETn)
DWM_READY: P8.2 U1.19(READY) ; port DWM_READY
DWM_RX: P8.3 U1.18(UART_RX) ; port DWM_RX
DWM_RX_LED: R11.1 U1.31(GPIO_2)
DWM_SCL: P6.1 U1.25(GPIO_8)
DWM_SDA: P6.2 U1.23(GPIO_15)
DWM_SPI_CLK: P5.3 U1.28(SPIS_CLK) ; port DWM_SPI_CLK
DWM_SPI_CSn: P5.2 U1.29(SPIS_CSn) ; port DWM_SPI_CSn
DWM_SPI_MISO: P5.5 U1.26(SPIS_MISO) ; port DWM_SPI_MISO
DWM_SPI_MOSI: P5.4 U1.27(SPIS_MOSI) ; port DWM_SPI_MOSI
DWM_SWCLK: P4.2 U1.2(SWD_CLK)
DWM_SWDIO: P4.1 U1.3(SWD_DIO)
DWM_TX: P8.1 U1.20(UART_TX) ; port DWM_TX
DWM_TX_LED: R10.1 U1.30(GPIO_3)
NetD3_1: D3.1(K) U1.7(GPIO_14)
NetD3_2: D3.2(A) R4.2
NetD4_1: D4.1(K) U1.8(GPIO_22)
NetD4_2: D4.2(A) R5.2
NetD5_1: D5.1(K) U1.9(GPIO_31)
NetD5_2: D5.2(A) R6.2
NetD6_1: D6.1(K) U1.10(GPIO_30)
NetD6_2: D6.2(A) R7.2
NetD7_2: D7.2(A) R10.2
NetD8_2: D8.2(A) R11.2

Not connected (* = marked no-connect by the designer): U1 4(GPIO_10)* 5(GPIO_9)* 6(GPIO_12)* 13(GPIO_27)* 14(I2C_SDA)* 15(I2C_SCL)* 16(GPIO_23)* 17(GPIO_13)* 21(GPIO_1)* 22(GPIO_0)*

### Library data of the parts
C3-C5 = Cap-100nF-50V-0805: as C21 on sheet power supply; Local Supplier: thegioiic; Local Supplier Link: https://thegioiic.com/products/tu-100nf-0-1uf-50v-0805; Supplier 1: Digikey; Supplier 1 Part Number: 1276-1007-1-ND; Supplier 1 Link: https://www.digikey.com/product-detail/en/samsung-electro-mechanics/CL21F104ZBCNNNC/1276-1007-1-ND/3889093
D3 D4 D7 D8 = 150080RS75000: as D9 on sheet MCU; Viewing Angle: 140deg; ComponentLink1Description: Manufacturer; ComponentLink1URL: http://www.we-online.de; ComponentLink2URL: https://www.we-online.com/catalog/datasheet/150080RS75000.pdf; ComponentLink2Description: Datasheet; Forward Voltage typ.: 2V; Emitting Color: Red; Mounting Technology: SMT; Operating Temperature: -40 to +85degC; Published Date: December 2019; Part Number: 150080RS75000; Packaging: Tape and Reel; Size: 0805; Publisher: Wurth Elektronik
D5 = 150080YS75000: as D1 on sheet bluetooth; Viewing Angle: 140deg; ComponentLink1Description: Manufacturer; ComponentLink1URL: http://www.we-online.de; ComponentLink2URL: https://www.we-online.com/catalog/datasheet/150080YS75000.pdf; ComponentLink2Description: Datasheet; Forward Voltage typ.: 2V; Emitting Color: Yellow; Mounting Technology: SMT; Operating Temperature: -40 to +85degC; Published Date: December 2019; Part Number: 150080YS75000; Packaging: Tape and Reel; Size: 0805; Publisher: Wurth Elektronik
D6 = 150080VS75000: WL-SMCW SMT Mono-color Chip LED Waterclear, size 0805, Bright Green, 2V, 140deg; Chip Technology: AlInGaP; Dominant Wavelength typ.: 570nm; Luminous Intensity typ.: 40mcd; Peak Wavelength typ.: 572nm; Viewing Angle: 140deg; ComponentLink1Description: Manufacturer; ComponentLink1URL: http://www.we-online.de; ComponentLink2URL: https://www.we-online.com/catalog/datasheet/150080VS75000.pdf; ComponentLink2Description: Datasheet; Forward Voltage typ.: 2V; Emitting Color: Bright Green; Mounting Technology: SMT; Operating Temperature: -40 to +85degC; Published Date: December 2019; Part Number: 150080VS75000; Packaging: Tape and Reel; Size: 0805; Publisher: Wurth Elektronik
P3 P7 = Header 2: Header, 2-Pin; LatestRevisionDate: 17-Jul-2002; LatestRevisionNote: Re-released for DXP Platform.; Publisher: Altium Limited
P4 P8 = Header 4: Header, 4-Pin; LatestRevisionDate: 17-Jul-2002; LatestRevisionNote: Re-released for DXP Platform.; Publisher: Altium Limited
P5 = Header 5: Header, 5-Pin; LatestRevisionDate: 17-Jul-2002; LatestRevisionNote: Re-released for DXP Platform.; Publisher: Altium Limited
P6 = Header 3: Header, 3-Pin; LatestRevisionDate: 17-Jul-2002; LatestRevisionNote: Re-released for DXP Platform.; Publisher: Altium Limited
R4-R7 R10 R11 = Res-1K-0805: as R17 on sheet MCU; Local Supplier: thegioiic; Local Supplier Link: https://thegioiic.com/products/dien-tro-1k-ohm-0805-5; Supplier 1: Digikey; Supplier 1 Link: https://www.digikey.com/product-detail/en/stackpole-electronics-inc/RNCP0805FTD1K00/RNCP0805FTD1K00CT-ND/2240568; Supplier 1 Part Number: RNCP0805FTD1K00CT-ND
R8 R9 = Res-10k-0805: as R12 on sheet MCU; Local Supplier: thegioiic; Local Supplier Link: https://thegioiic.com/products/dien-tro-10k-ohm-0805-5; Supplier 1: Digikey; Supplier 1 Link: https://www.digikey.com/product-detail/en/stackpole-electronics-inc/RNCP0805FTD10K0/RNCP0805FTD10K0CT-ND/2240601; Supplier 1 Part Number: RNCP0805FTD10K0CT-ND
S2 S3 = 434113043826: as S4 on sheet MCU; ComponentLink1Description: Manufacturer; ComponentLink1URL: http://www.we-online.de; ComponentLink2Description: Datasheet; ComponentLink2URL: https://katalog.we-online.com/em/datasheet/434113043826.pdf; Operating Temperature: -40 to +85degC; Part Number: 434113043826; Published Date: September 2019; Contact Material: Stainless Steel; Height: 4.3mm; Mounting Technology: SMT; Contact Plating: Silver; Operation Force: 260gf; Packaging: Tape and Reel; Terminal Material: Copper Alloy; Publisher: Wurth Elektronik; Terminal Plating: Silver

## Sheet wifi.SchDoc
size A
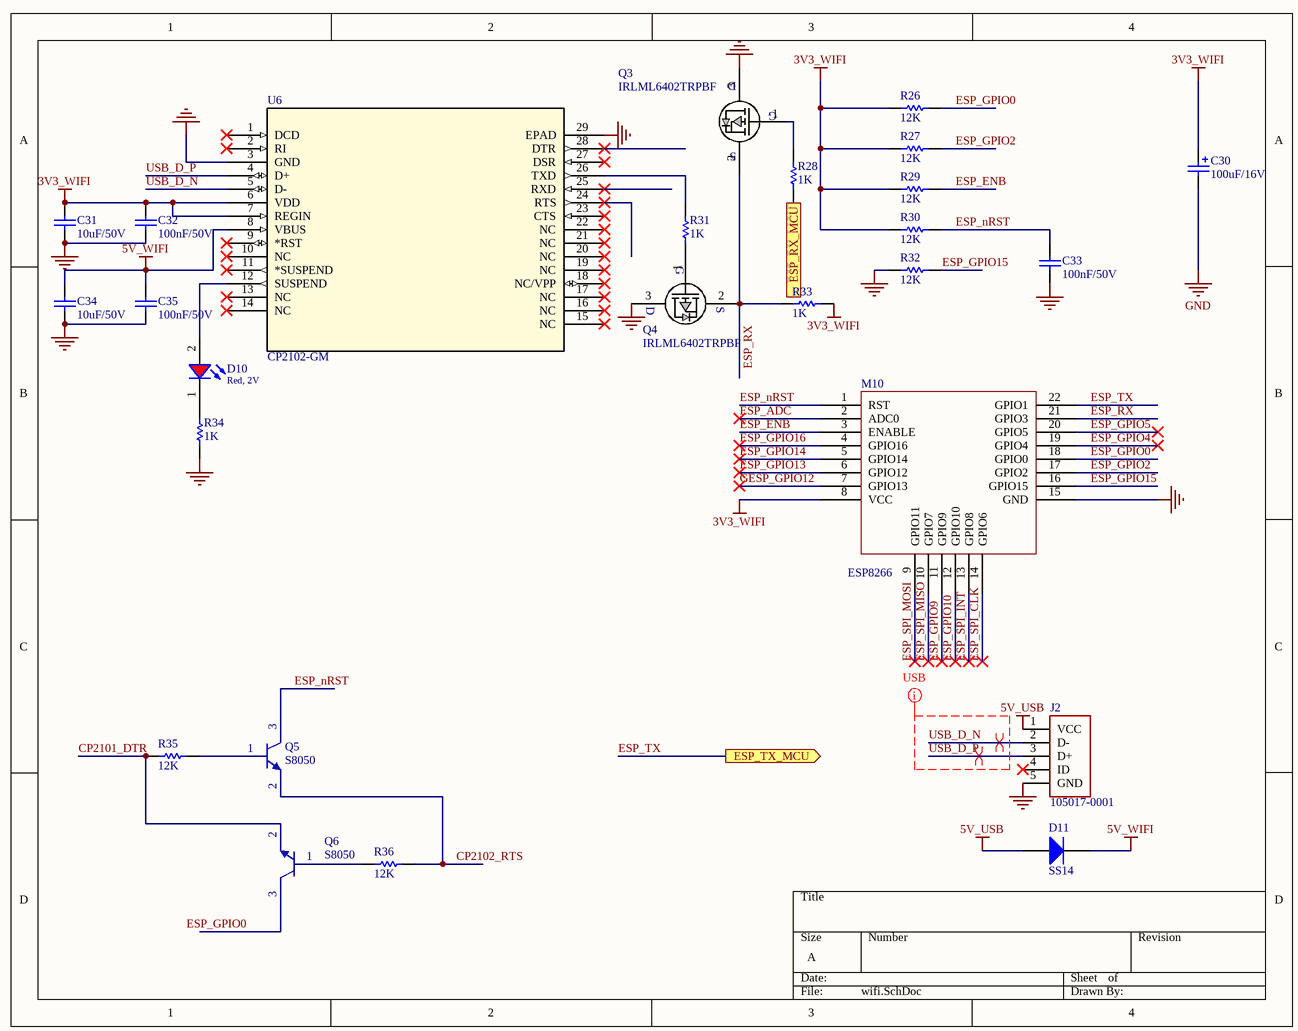
[diagram p6: wifi.SchDoc]

### Parts
C30  value 100uF/16V  [CAP_SM_TAN]  (hidden comment: TAJB107M006RNJ)
C31  value 10uF/50V  [CAP-SM-0805]  (hidden comment: Cap-10uF-50V-0805)
C32  value 100nF/50V  [CAP-SM-0805]  (hidden comment: Cap-100nF-50V-0805)
C33  value 100nF/50V  [CAP-SM-0805]  (hidden comment: Cap-100nF-50V-0805)
C34  value 10uF/50V  [CAP-SM-0805]  (hidden comment: Cap-10uF-50V-0805)
C35  value 100nF/50V  [CAP-SM-0805]  (hidden comment: Cap-100nF-50V-0805)
D10  Red, 2V  [WL-SMCW_0805]
D11  SS14  [SS14]
J2  105017-0001  [CONN_105017-0001]
M10  ESP8266  [ESP8266]
Q3  IRLML6402TRPBF  [SOT23_NEX]
Q4  IRLML6402TRPBF  [SOT23_NEX]
Q5  S8050  [SOT23_NEX]
Q6  S8050  [SOT23_NEX]
R26  value 12K  [RES-SM-0805]  (hidden comment: Res-12K-0805)
R27  value 12K  [RES-SM-0805]  (hidden comment: Res-12K-0805)
R28  value 1K  [RES-SM-0805]  (hidden comment: Res-1K-0805)
R29  value 12K  [RES-SM-0805]  (hidden comment: Res-12K-0805)
R30  value 12K  [RES-SM-0805]  (hidden comment: Res-12K-0805)
R31  value 1K  [RES-SM-0805]  (hidden comment: Res-1K-0805)
R32  value 12K  [RES-SM-0805]  (hidden comment: Res-12K-0805)
R33  value 1K  [RES-SM-0805]  (hidden comment: Res-1K-0805)
R34  value 1K  [RES-SM-0805]  (hidden comment: Res-1K-0805)
R35  value 12K  [RES-SM-0805]  (hidden comment: Res-12K-0805)
R36  value 12K  [RES-SM-0805]  (hidden comment: Res-12K-0805)
U6  CP2102-GM  [CP2102-GM]

### Ports
ESP_RX_MCU (in), ESP_TX_MCU (out)

### Nets
3V3_WIFI: C30.1 C31.2 C32.2 M10.8(VCC) R26.1 R27.1 R29.1 R30.1 R33.2 U6.6(VDD) U6.7(REGIN)
5V_USB: D11.2(A) J2.1(VCC)
5V_WIFI: C34.2 C35.1 D11.1(K) U6.8(VBUS)
GND: C30.2 C31.1 C32.1 C33.1 C34.1 C35.2 J2.5(GND) M10.15(GND) Q3.3(D) Q4.3(D) R32.1 R34.1 U6.3(GND) U6.29(EPAD)
CP2101_DTR: Q6.2(E) R35.1
CP2102_RTS: Q5.2(E) R36.2
ESP_ADC: M10.2(ADC0)
ESP_ENB: M10.3(ENABLE) R29.2
ESP_GPIO0: M10.18(GPIO0) R26.2
ESP_GPIO2: M10.17(GPIO2) R27.2
ESP_GPIO4: M10.19(GPIO4)
ESP_GPIO5: M10.20(GPIO5)
ESP_GPIO9: M10.11(GPIO9)
ESP_GPIO10: M10.12(GPIO10)
ESP_GPIO13: M10.6(GPIO12)
ESP_GPIO14: M10.5(GPIO14)
ESP_GPIO15: M10.16(GPIO15) R32.2
ESP_GPIO16: M10.4(GPIO16)
ESP_nRST: C33.2 M10.1(RST) Q5.3(C) R30.2
ESP_RX: M10.21(GPIO3) Q3.2(S) Q4.2(S) R33.1
ESP_SPI_CLK: M10.14(GPIO6)
ESP_SPI_INT: M10.13(GPIO8)
ESP_SPI_MISO: M10.10(GPIO7)
ESP_SPI_MOSI: M10.9(GPIO11)
ESP_TX: M10.22(GPIO1) ; port ESP_TX_MCU
GESP_GPIO12: M10.7(GPIO13)
USB_D_N: J2.2(D-) U6.5(D-)
USB_D_P: J2.3(D+) U6.4(D+)
NetD10_1: D10.1(K) R34.2
NetD10_2: D10.2(A) U6.12(SUSPEND)
NetQ3_1: Q3.1(G) R28.2
NetQ4_1: Q4.1(G) R31.1
NetQ5_1: Q5.1(B) R35.2
NetQ6_1: Q6.1(B) R36.1
NetR28_1: R28.1 ; port ESP_RX_MCU
NetR31_2: R31.2 U6.26(TXD)

Not connected (* = marked no-connect by the designer): J2 4(ID)*; Q6 3(C); U6 1(DCD)* 2(RI)* 9(*RST)* 10(NC)* 11(*SUSPEND)* 13(NC)* 14(NC)* 15(NC)* 16(NC)* 17(NC)* 18(NC/VPP)* 19(NC)* 20(NC)* 21(NC)* 22(NC)* 23(CTS)* 24(RTS)* 25(RXD)* 27(DSR)* 28(DTR)*

### Layout directives
differential pair: USB_D_N, USB_D_P
mark named USB: USB_D_N, USB_D_P

### Notes on the sheet
- Labels drawn without touching a wire or pin: ESP_GPIO0

### Library data of the parts
C30 = Cap-Tan-100uF-16V: Manufacturer: Nichicon; Manufacturer Part Number: UWX1C101MCL1GB; Local Supplier: icdayroi; Local Supplier Link: https://icdayroi.com/tu-tantalum-100uf-16v-smd6032; Supplier 1: Digikey; Supplier 1 Part Number: 493-2105-1-ND; Supplier 1 Link: https://www.digikey.com/product-detail/en/nichicon/UWX1C101MCL1GB/493-2105-1-ND/590080
C31 C34 = Cap-10uF-50V-0805: as C15 on sheet power supply; Local Supplier: thegioiic; Local Supplier Link: https://thegioiic.com/products/tu-10uf-50v-0805; Supplier 1: Digikey; Supplier 1 Link: https://www.digikey.com/product-detail/en/yageo/CC0805KKX5R9BB106/311-3499-2-ND/7164383; Supplier 1 Part Number: 311-3499-2-ND
C32 C33 C35 = Cap-100nF-50V-0805: as C21 on sheet power supply; Local Supplier: thegioiic; Local Supplier Link: https://thegioiic.com/products/tu-100nf-0-1uf-50v-0805; Supplier 1: Digikey; Supplier 1 Part Number: 1276-1007-1-ND; Supplier 1 Link: https://www.digikey.com/product-detail/en/samsung-electro-mechanics/CL21F104ZBCNNNC/1276-1007-1-ND/3889093
D10 = 150080RS75000: as D9 on sheet MCU; Viewing Angle: 140deg; ComponentLink1Description: Manufacturer; ComponentLink1URL: http://www.we-online.de; ComponentLink2URL: https://www.we-online.com/catalog/datasheet/150080RS75000.pdf; ComponentLink2Description: Datasheet; Forward Voltage typ.: 2V; Emitting Color: Red; Mounting Technology: SMT; Operating Temperature: -40 to +85degC; Published Date: December 2019; Part Number: 150080RS75000; Packaging: Tape and Reel; Size: 0805; Publisher: Wurth Elektronik
D11 = Diode-SS14: DIODE SCHOTTKY 40V 1A SMA; Manufacturer: ON Semiconductor; Local Supplier: thegioiic; Local Supplier Link: https://thegioiic.com/products/ss14-sma; Supplier 1: Digikey; Supplier 1 Link: https://www.digikey.com/product-detail/en/on-semiconductor/SS14/SS14CT-ND/965729; Manufacturer Part Number: SS14; Supplier 1 Part Number: SS14CT-ND
J2 = 105017-0001: No Description Available; Vendor: Molex Connector Corporation; Built_By: EMA_Cory; SourceLibrary: Molex_2020-05-26; Datasheet: https://www.molex.com/pdm_docs/sd/1050170001_sd.pdf; Manufacturer_Part_Number: 105017-0001; Copyright: Copyright (C) 2018 Accelerated Designs. All rights reserved; RefDes: RefDes; Type: DEV
Q3 Q4 = IRLML6402TRPBF: P-Channel 20V 3.7A (Ta) 1.3W (Ta) Surface Mount Micro3™/SOT-23
R26 R27 R29 R30 R32 R35 R36 = Res-12K-0805: RES 12 KOHM JUMPER 0805; Manufacturer: Vishay Thin Film; Manufacturer Part Number: PAT0805E3121BST1; Local Supplier: icdayroi; Local Supplier Link: https://icdayroi.com/dien-tro-12k-0805-1-goi-50-con; Supplier 1: Digikey; Supplier 1 Link: https://www.digikey.com/product-detail/en/vishay-thin-film/PAT0805E3121BST1/PAT0805E3121BST1-ND/2281536; Supplier 1 Part Number: PAT0805E3121BST1-ND
R28 R31 R33 R34 = Res-1K-0805: as R17 on sheet MCU; Local Supplier: thegioiic; Local Supplier Link: https://thegioiic.com/products/dien-tro-1k-ohm-0805-5; Supplier 1: Digikey; Supplier 1 Link: https://www.digikey.com/product-detail/en/stackpole-electronics-inc/RNCP0805FTD1K00/RNCP0805FTD1K00CT-ND/2240568; Supplier 1 Part Number: RNCP0805FTD1K00CT-ND
U6 = CP2102-GM: No Description Available; Vendor: Silicon Labs; Built_By: EMA_UL_Team; SourceLibrary: Silicon_Labs_2015-03-23; Manufacturer_Part_Number: CP2102-GM; Copyright: Copyright (C) 2018 Accelerated Designs. All rights reserved; RefDes: RefDes; Type: DEV

## Sheet radio_frequency.SchDoc
size A
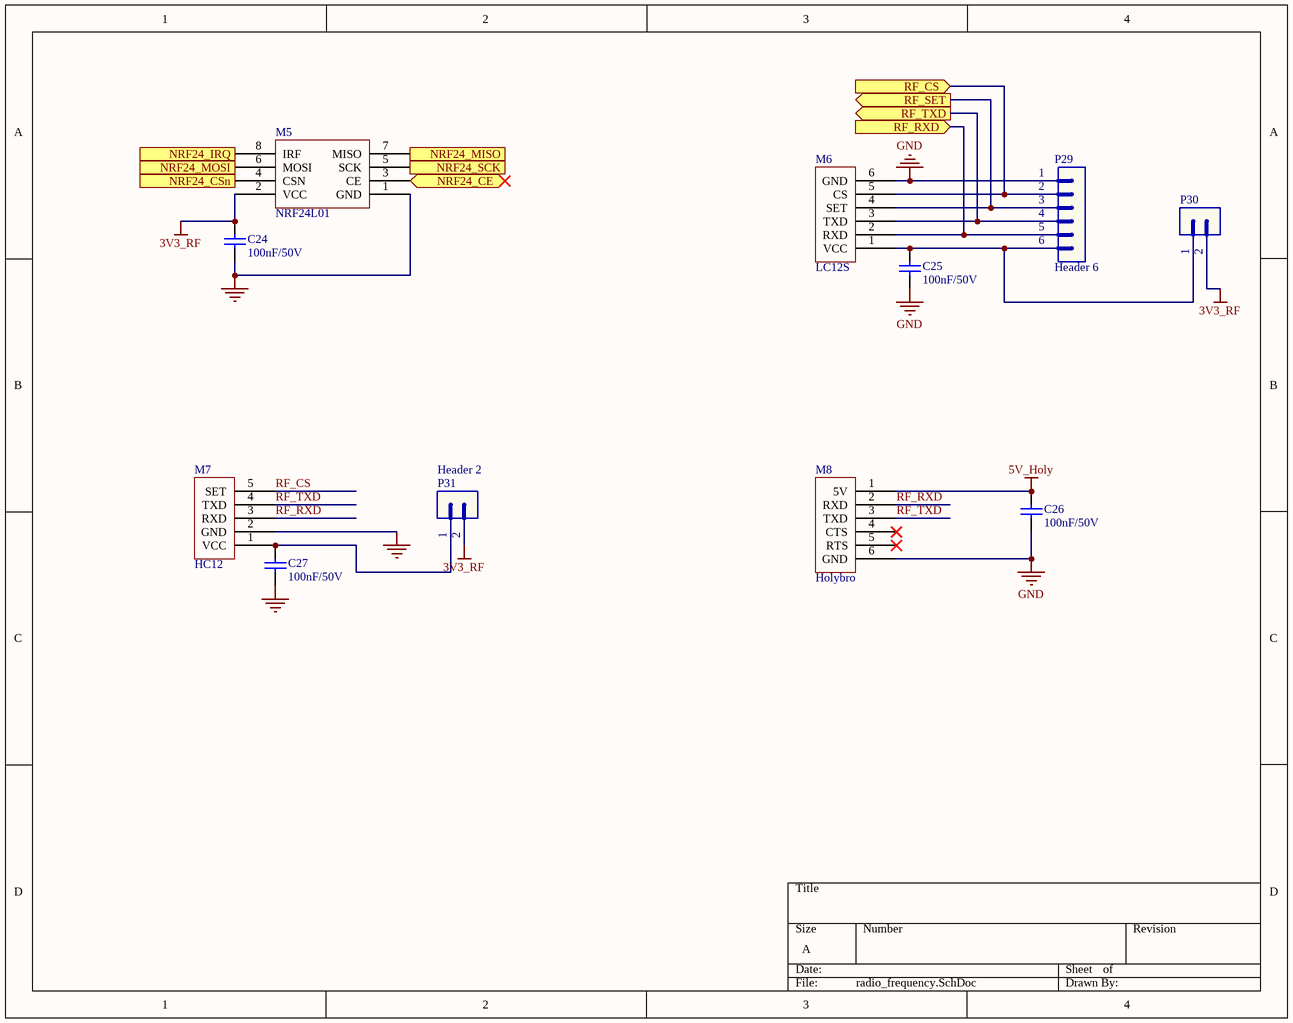
[diagram p7: radio_frequency.SchDoc]

### Parts
C24  value 100nF/50V  [CAP-SM-0805]  (hidden comment: Cap-100nF-50V-0805)
C25  value 100nF/50V  [CAP-SM-0805]  (hidden comment: Cap-100nF-50V-0805)
C26  value 100nF/50V  [CAP-SM-0805]  (hidden comment: Cap-100nF-50V-0805)
C27  value 100nF/50V  [CAP-SM-0805]  (hidden comment: Cap-100nF-50V-0805)
M5  NRF24L01  [NRF24L01]
M6  LC12S  [LC12S]
M7  HC12  [HC12]
M8  Holybro  [Holybro]
P29  Header 6  [JP6]
P30  Header 2  [JP2]  (value not drawn)
P31  Header 2  [JP2]

### Ports
NRF24_CE (bidir), NRF24_CSn (in), NRF24_IRQ (out), NRF24_MISO (out), NRF24_MOSI (in), NRF24_SCK (in), RF_CS (in), RF_RXD (in), RF_SET (out), RF_TXD (out)

### Nets
3V3_RF: C24.2 M5.2(VCC) P30.2 P31.2
5V_Holy: C26.2 M8.1(5V)  [project net 5V]
GND: C24.1 C25.2 C26.1 C27.1 M5.1(GND) M6.6(GND) M7.2(GND) M8.6(GND) P29.1
RF_CS: M7.5(SET)
RF_RXD: M7.3(RXD) M8.2(RXD)
RF_TXD: M7.4(TXD) M8.3(TXD)
NetC25_1: C25.1 M6.1(VCC) P29.6 P30.1
NetC27_2: C27.2 M7.1(VCC) P31.1
NetM5_3: M5.3(CE) ; port NRF24_CE
NetM5_4: M5.4(CSN) ; port NRF24_CSn
NetM5_5: M5.5(SCK) ; port NRF24_SCK
NetM5_6: M5.6(MOSI) ; port NRF24_MOSI
NetM5_7: M5.7(MISO) ; port NRF24_MISO
NetM5_8: M5.8(IRF) ; port NRF24_IRQ
NetM6_2: M6.2(RXD) P29.5 ; port RF_RXD
NetM6_3: M6.3(TXD) P29.4 ; port RF_TXD
NetM6_4: M6.4(SET) P29.3 ; port RF_SET
NetM6_5: M6.5(CS) P29.2 ; port RF_CS

Not connected (* = marked no-connect by the designer): M8 4(CTS)* 5(RTS)*

### Library data of the parts
C24-C27 = Cap-100nF-50V-0805: as C21 on sheet power supply; Local Supplier: thegioiic; Local Supplier Link: https://thegioiic.com/products/tu-100nf-0-1uf-50v-0805; Supplier 1: Digikey; Supplier 1 Part Number: 1276-1007-1-ND; Supplier 1 Link: https://www.digikey.com/product-detail/en/samsung-electro-mechanics/CL21F104ZBCNNNC/1276-1007-1-ND/3889093
P29 = Header 6: Header, 6-Pin; LatestRevisionDate: 17-Jul-2002; LatestRevisionNote: Re-released for DXP Platform.; Publisher: Altium Limited
P30 P31 = Header 2: Header, 2-Pin; LatestRevisionDate: 17-Jul-2002; LatestRevisionNote: Re-released for DXP Platform.; Publisher: Altium Limited
M6 = LC12S: Local Supplier: HShop; Local Supplier Link: https://hshop.vn/products/mach-thu-phat-rf-uart-lc12s-2-4ghz?fbclid=IwAR1M9YDa-GitOgYklxeG5eoXHMme_RQQZ19pTuO3FE9QmjSNk3aG2x454fg; Local Supplier Part Number: HS000895; Manufacturer: *; Manufacturer Part Number: *

## Nets that join several sheets
3V3_BLU: power supply (C23.2 IC4.2 IC4.4), bluetooth (M2.12 S1.1)
3V3_DWM: power supply (C20.2 IC3.2 IC3.4), decawave (P7.2)
3V3_MC: power supply (C18.2 C19.2 IC2.2 IC2.4), MCU (12 pins), sensor (6 pins), motor_controller (11 pins)
3V3_RF: power supply (C22.2 U4.5), radio_frequency (C24.2 M5.2 P30.2 P31.2)
3V3_WIFI: power supply (C17.2 IC1.2 IC1.4), wifi (11 pins)
5V: power supply (10 pins), MCU (B1.1 J1.1), motor_controller (P13.3), bluetooth (C1.2 M1.5), radio_frequency (C26.2 M8.1)
5V_WIFI: power supply (IC1.3 P28.2), wifi (C34.2 C35.1 D11.1 U6.8)
12V: power supply (C14.1 C15.2 P25.1 P26.1), motor_controller (P12.1 P14.1)
GND: power supply (19 pins), MCU (16 pins), sensor (6 pins), motor_controller (19 pins), bluetooth (10 pins), decawave (16 pins), wifi (14 pins), radio_frequency (9 pins)
BLUE_RX: MCU (U2.30), bluetooth (M1.2 M2.2 P2.2)
BLUE_TX: MCU (U2.31), bluetooth (M1.3 M2.1 P2.1)
DWM_SPI_CLK: MCU (U2.26), decawave (P5.3 U1.28)
DWM_SPI_CSn: MCU (U2.25), decawave (P5.2 U1.29)
DWM_SPI_MISO: MCU (U2.27), decawave (P5.5 U1.26)
DWM_SPI_MOSI: MCU (U2.28), decawave (P5.4 U1.27)
ESP_TX: MCU (U2.13), wifi (M10.22)
NetM2_11: MCU (U2.14), bluetooth (M2.11)
NetM5_4: MCU (U2.38), radio_frequency (M5.4)
NetM5_5: MCU (U2.39), radio_frequency (M5.5)
NetM5_6: MCU (U2.41), radio_frequency (M5.6)
NetM5_7: MCU (U2.40), radio_frequency (M5.7)
NetM5_8: MCU (U2.33), radio_frequency (M5.8)
NetM6_2: MCU (U2.21), radio_frequency (M6.2 P29.5)
NetM6_3: MCU (U2.22), radio_frequency (M6.3 P29.4)
NetM6_4: MCU (U2.19), radio_frequency (M6.4 P29.3)
NetM9_3: MCU (U2.45), sensor (M9.3)
NetM9_4: MCU (U2.46), sensor (M9.4)
NetR25_1: power supply (R25.1), MCU (U2.15)
NetR28_1: MCU (U2.12), wifi (R28.1)
NetU2_3: MCU (U2.3), motor_controller (U3.3)
NetU2_4: MCU (U2.4), motor_controller (U3.6)
NetU2_5: MCU (U2.5), motor_controller (U3.5)
NetU2_6: MCU (U2.6), motor_controller (U3.7)
NetU2_10: MCU (U2.10), motor_controller (U3.2)
NetU2_11: MCU (U2.11), motor_controller (U3.4)
NetU2_16: MCU (U2.16), sensor (U5.2)
NetU2_17: MCU (U2.17), sensor (U5.4)
NetU2_42: MCU (U2.42), sensor (U5.8)
NetU2_43: MCU (U2.43), sensor (U5.6)